# Altium project NC1-1BB.PrjPcb
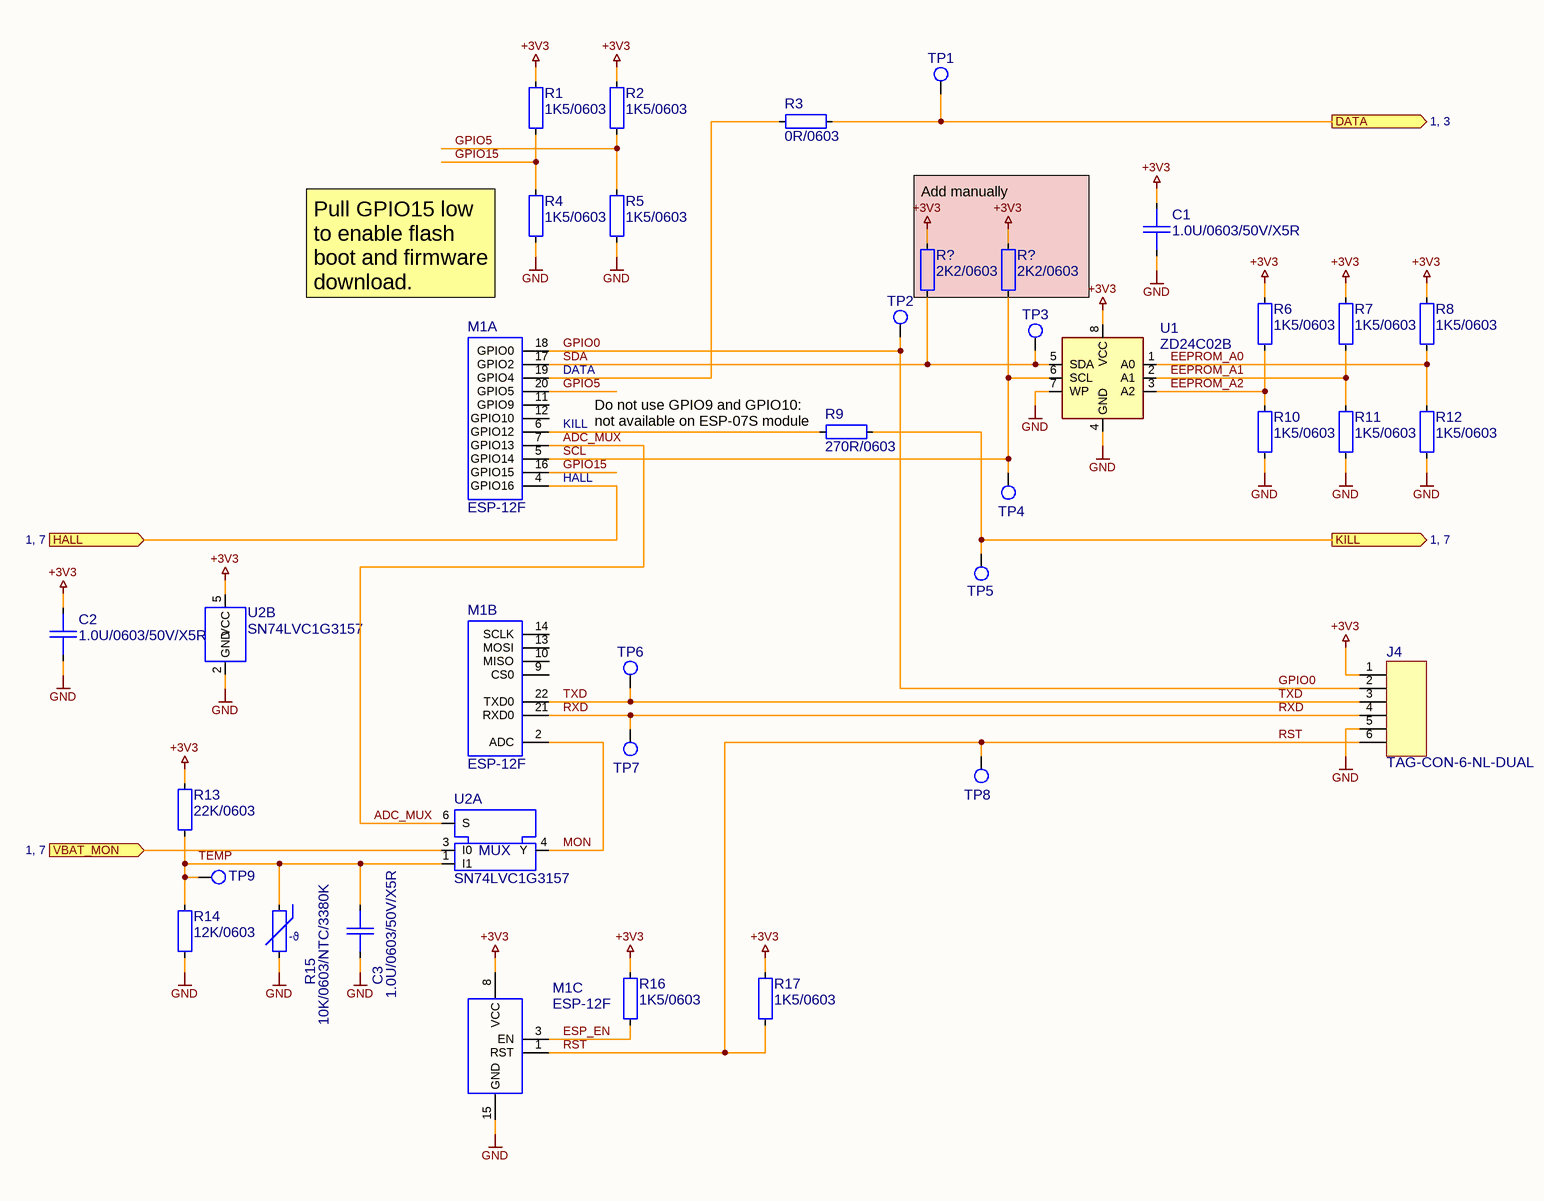
[diagram p0: Control.SchDoc]
Author: ahorat / daniw; Index_Main: B; Index_Sub: B; Layout_Designer: daniw; PCB_NAME: NC1-1; Project: NightCone; Schema_Designer: ahorat / daniw
4 sheets, 129 parts. Net scope: hierarchical (ports join the sheet entries above them; power ports are global).
Board files: NC1-1B-BASIS.PcbDoc, NC1-1B-PANEL_Single.PcbDoc
Sheets:
  Control.SchDoc
  FailSafe.SchDoc
  Lights.SchDoc
  Power.SchDoc

## Sheet Control.SchDoc: Control Module
size A3; SheetNumber: 2; SheetTotal: 7

### Parts
(Parts that share a designator on the sheet are numbered #1, #2 ... from top to bottom, then left to right.)
C1  1.0U/0603/50V/X5R  [CAP0603_X7R]
C2  1.0U/0603/50V/X5R  [CAP0603_X7R]
C3  1.0U/0603/50V/X5R  [CAP0603_X7R]
J4  TAG-CON-6-NL-DUAL  [TC2030-NL-2]
M1  ESP-12F  [ESP-12F]  (parts A,B,C of 3)
R1  1K5/0603  [R0603-0.40-WW]
R2  1K5/0603  [R0603-0.40-WW]
R3  0R/0603  [R0603-0.40-WW]
R4  1K5/0603  [R0603-0.40-WW]
R5  1K5/0603  [R0603-0.40-WW]
R6  1K5/0603  [R0603-0.40-WW]
R7  1K5/0603  [R0603-0.40-WW]
R8  1K5/0603  [R0603-0.40-WW]
R9  270R/0603  [R0603-0.40-WW]
R10  1K5/0603  [R0603-0.40-WW]
R11  1K5/0603  [R0603-0.40-WW]
R12  1K5/0603  [R0603-0.40-WW]
R13  22K/0603  [R0603-0.40-WW]
R14  12K/0603  [R0603-0.40-WW]
R15  10K/0603/NTC/3380K  [R0603-0.40-WW]
R16  1K5/0603  [R0603-0.40-WW]
R17  1K5/0603  [R0603-0.40-WW]
R?#1  2K2/0603  [R0603-0.40-WW]
R?#2  2K2/0603  [R0603-0.40-WW]
TP1  TP_THD_1.5/0.8  [TP_THD_1.5/0.8]  (value not drawn)  (no BOM)
TP2  TP_THD_1.5/0.8  [TP_THD_1.5/0.8]  (value not drawn)  (no BOM)
TP3  TP_THD_1.5/0.8  [TP_THD_1.5/0.8]  (value not drawn)  (no BOM)
TP4  TP_THD_1.5/0.8  [TP_THD_1.5/0.8]  (value not drawn)  (no BOM)
TP5  TP_THD_1.5/0.8  [TP_THD_1.5/0.8]  (value not drawn)  (no BOM)
TP6  TP_THD_1.5/0.8  [TP_THD_1.5/0.8]  (value not drawn)  (no BOM)
TP7  TP_THD_1.5/0.8  [TP_THD_1.5/0.8]  (value not drawn)  (no BOM)
TP8  TP_THD_1.5/0.8  [TP_THD_1.5/0.8]  (value not drawn)  (no BOM)
TP9  TP_THD_1.5/0.8  [TP_THD_1.5/0.8]  (value not drawn)  (no BOM)
U1  ZD24C02B  [SOP127P600X155-8-SW]
U2  SN74LVC1G3157  [SOT65P210X95-6-SE]  (parts A,B of 2)

### Ports
DATA (out, see 1, 3), HALL (in, see 1, 7), KILL (out, see 1, 7), VBAT_MON (in, see 1, 7)

### Nets
+3V3: C1.1 C2.1 J4.1 M1.8(VCC) R1.1 R2.1 R6.1 R7.1 R8.1 R13.1 R16.1 R17.1 R?#1.1 R?#2.1 U1.8(VCC) U2.5(VCC)
GND: C1.2 C2.2 C3.2 J4.5 M1.15(GND) R4.2 R5.2 R10.2 R11.2 R12.2 R14.2 R15.2 U1.4(GND) U1.7(WP) U2.2(GND)
ADC_MUX: M1.7(GPIO13) U2.6(S)
EEPROM_A0: R8.2 R12.1 U1.1(A0)
EEPROM_A1: R7.2 R11.1 U1.2(A1)
EEPROM_A2: R6.2 R10.1 U1.3(A2)
ESP_EN: M1.3(EN) R16.2
GPIO0: J4.2 M1.18(GPIO0) TP2.1
GPIO5: M1.20(GPIO5) R2.2 R5.1
GPIO15: M1.16(GPIO15) R1.2 R4.1
MON: M1.2(ADC) U2.4(Y)
RST: J4.6 M1.1(RST) R17.2 TP8.1
RXD: J4.4 M1.21(RXD0) TP7.1
SCL: M1.5(GPIO14) R?#2.2 TP4.1 U1.6(SCL)
SDA: M1.17(GPIO2) R?#1.2 TP3.1 U1.5(SDA)
TEMP: C3.1 R13.2 R14.1 R15.1 TP9.1 U2.1(I1)
TXD: J4.3 M1.22(TXD0) TP6.1
NetM1_4: M1.4(GPIO16) ; port HALL
NetM1_6: M1.6(GPIO12) R9.1
NetM1_19: M1.19(GPIO4) R3.1
NetR3_2: R3.2 TP1.1 ; port DATA
NetR9_2: R9.2 TP5.1 ; port KILL
NetU2_3: U2.3(I0) ; port VBAT_MON

Not connected (* = marked no-connect by the designer): M1 9(CS0) 10(MISO) 11(GPIO9) 12(GPIO10) 13(MOSI) 14(SCLK)

### Notes on the sheet
- Pull GPIO15 low to enable flash boot and firmware download.
- (near R?#1) Add manually
- (near M1) DATA
- (near M1) KILL
- (near M1) HALL
- (near R9) Do not use GPIO9 and GPIO10:
  not available on ESP-07S module
- Date:
- Size:
- A3
- Schema:
- Layout:
- (in symbol 10K/0603/NTC/3380K) -ϑ
- (in symbol SN74LVC1G3157, part A) MUX

### Library data of the parts
C1-C3 = 1.0U/0603/50V/X5R: CAP SM 0603 1.0uF 50V X5R; Manufacturer: GENERIC; Manufacturer 1: Samsung Electro-Mechanics; Manufacturer Part Number 1: CL10A105KB8NNNC; Absolute Value: 1E-6; Eurocircuits GPN: GPC0603105-X5R; Part Number: 1.0U/0603/50V/X5R; Package: 0603; Value: 1.0uF; Manufacturer Part Number 3: CL10A105KB8NNNC; Supplier 3: LCSC; Supplier Part Number 3: C15849; JLC Type: Basic; HelpURL: https://mm.digikey.com/Volume0/opasdata/d220001/medias/docus/658/CL10A105KB8NNNC_Spec.pdf; Supplier 1: Digi-Key; Supplier Part Number 1: 1276-1860-1-ND
J4 = TAG-CON-6-NL-DUAL: Tag-Connect 2030-NL, 6 pins, no legs, two-sided; Part Number: TAG-CON-6-NL-DUAL; Manufacturer: TAG-CONNECT; HelpURL: https://www.tag-connect.com/wp-content/uploads/bsk-pdf-manager/2022/06/TC2030-MCP-NL.pdf
M1 = ESP-12F: ESP8266 based Module with 4MByte Storage; Manufacturer: AI-Thinker; Part Number: ESP-12F; Package: Board; Manufacturer 3: Ai-Thinker; Manufacturer Part Number 3: ESP-12F(ESP8266MOD); Supplier 3: LCSC; Supplier Part Number 3: C82891; JLC Type: Extended
R1 R2 R4-R8 R10-R12 R16 R17 = 1K5/0603: RES SM 0603 1K5; Manufacturer: GENERIC; Manufacturer 1: YAGEO; Manufacturer Part Number 1: RC0603FR-131K5L; Absolute Value: 1500; Part Number: 1K5/0603; Package: 0603; Value: 1K5; HelpURL: https://www.yageo.com/upload/media/product/app/datasheet/rchip/pyu-rc_group_51_rohs_l.pdf; Supplier 1: Digi-Key; Supplier Part Number 1: 13-RC0603FR-131K5LCT-ND; Manufacturer 2: YAGEO; Manufacturer Part Number 2: RC0603FR-101K5L; Supplier 2: Digi-Key; Supplier Part Number 2: 13-RC0603FR-101K5LCT-ND; Manufacturer 3: UNI-ROYAL(Uniroyal Elec); Manufacturer Part Number 3: 0603WAF1501T5E; Supplier 3: LCSC; Supplier Part Number 3: C22843; JLC Type: Basic
R3 = 0R/0603: RES SM 0603 0R; Manufacturer: GENERIC; Manufacturer 1: YAGEO; Manufacturer Part Number 1: RC0603FR-070RL; Absolute Value: 0; Eurocircuits GPN: GPR06030R; Part Number: 0R/0603; Package: 0603; Value: 0R; HelpURL: https://www.yageo.com/upload/media/product/app/datasheet/rchip/pyu-rc_group_51_rohs_l.pdf; Supplier 1: Digi-Key; Supplier Part Number 1: 311-0.0HRCT-ND; Manufacturer 2: YAGEO; Manufacturer Part Number 2: RC0603FR-130RL; Supplier 2: Digi-Key; Supplier Part Number 2: 13-RC0603FR-130RLCT-ND; Manufacturer 3: UNI-ROYAL(Uniroyal Elec); Manufacturer Part Number 3: 0603WAF0000T5E; Supplier 3: LCSC; Supplier Part Number 3: C21189; JLC Type: Basic
R9 = 270R/0603: RES SM 0603 270R; Manufacturer: GENERIC; Manufacturer 1: YAGEO; Manufacturer Part Number 1: RC0603FR-13270RL; Absolute Value: 270; Eurocircuits GPN: GPR0603270R; Part Number: 270R/0603; Package: 0603; Value: 270R; HelpURL: https://www.yageo.com/upload/media/product/productsearch/datasheet/rchip/PYu-RC_Group_51_RoHS_L_12.pdf; Supplier 1: Digi-Key; Supplier Part Number 1: 13-RC0603FR-13270RLCT-ND; Manufacturer 2: YAGEO; Manufacturer Part Number 2: RC0603FR-10270RL; Supplier 2: Digi-Key; Supplier Part Number 2: 13-RC0603FR-10270RLCT-ND; Manufacturer 3: UNI-ROYAL(Uniroyal Elec); Manufacturer Part Number 3: 0603WAF2700T5E; Supplier 3: LCSC; Supplier Part Number 3: C22966; JLC Type: Basic
R13 = 22K/0603: RES SM 0603 22K; Manufacturer: GENERIC; Manufacturer 1: YAGEO; Manufacturer Part Number 1: RC0603FR-1322KL; Absolute Value: 22000; Eurocircuits GPN: GPR060322K; Part Number: 22K/0603; Package: 0603; Value: 22K; HelpURL: https://www.yageo.com/upload/media/product/app/datasheet/rchip/pyu-rc_group_51_rohs_l.pdf; Supplier 1: Digi-Key; Supplier Part Number 1: 13-RC0603FR-1322KLCT-ND; Manufacturer 2: YAGEO; Manufacturer Part Number 2: RC0603FR-1022KL; Supplier 2: Digi-Key; Supplier Part Number 2: 13-RC0603FR-1022KLCT-ND; Manufacturer 3: UNI-ROYAL(Uniroyal Elec); Manufacturer Part Number 3: 0603WAF2202T5E; Supplier 3: LCSC; Supplier Part Number 3: C31850; JLC Type: Basic
R14 = 12K/0603: RES SM 0603 12K; Manufacturer: GENERIC; Manufacturer 1: YAGEO; Manufacturer Part Number 1: RC0603FR-1312KL; Absolute Value: 12000; Eurocircuits GPN: GPR060312K; Part Number: 12K/0603; Package: 0603; Value: 12K; HelpURL: https://www.yageo.com/upload/media/product/app/datasheet/rchip/pyu-rc_group_51_rohs_l.pdf; Supplier 1: Digi-Key; Supplier Part Number 1: 13-RC0603FR-1312KLCT-ND; Manufacturer 2: YAGEO; Manufacturer Part Number 2: RC0603FR-1012KL; Supplier 2: Digi-Key; Supplier Part Number 2: 13-RC0603FR-1012KLCT-ND
R15 = 10K/0603/NTC/3380K: RES NTC SM 0603 10K; Manufacturer: GENERIC; Manufacturer 1: Murata; Manufacturer Part Number 1: NCU18XH103E60RB; Absolute Value: 10000; Part Number: 10K/0603/NTC/3380K; Package: 603; Value: 10K; HelpURL: https://www.murata.com/en-us/api/pdfdownloadapi?cate=luNTCforTempeSenso&partno=NCU18XH103E60RB; Supplier 1: Digi-Key; Supplier Part Number 1: 490-18164-1-ND; Manufacturer 3: Sunlord; Manufacturer Part Number 3: SDNT1608X103F3380FTF; Supplier 3: LCSC; Supplier Part Number 3: C316397; JLC Type: Extended
R?#1 R?#2 = 2K2/0603: RES SM 0603 2K2; Manufacturer: GENERIC; Manufacturer 1: YAGEO; Manufacturer Part Number 1: RC0603FR-132K2L; Absolute Value: 2200; Eurocircuits GPN: GPR06032K2; Part Number: 2K2/0603; Package: 0603; Value: 2K2; HelpURL: https://www.yageo.com/upload/media/product/app/datasheet/rchip/pyu-rc_group_51_rohs_l.pdf; Supplier 1: Digi-Key; Supplier Part Number 1: 13-RC0603FR-132K2LCT-ND; Manufacturer 2: YAGEO; Manufacturer Part Number 2: RC0603FR-102K2L; Supplier 2: Digi-Key; Supplier Part Number 2: 13-RC0603FR-102K2LCT-ND; Manufacturer 3: YAGEO; Manufacturer Part Number 3: RC0603JR-072K2L; Supplier 3: LCSC; Supplier Part Number 3: C113303
TP1-TP9 = TP_THD_1.5/0.8: THT Test Point 1.5/0.8mm; Manufacturer: NONE; Part Number: TP_THD_1.5/0.8
U1 = ZD24C02B: I2C-Compatible (2-wire) Serial EEPROM 2K bits; Manufacturer: Zetta; Part Number: ZD24C02B; Package: SOIC-8; HelpURL: https://datasheet.lcsc.com/lcsc/2402020955_Zetta-ZD24C02B-SSGMB_C5374786.pdf; Manufacturer 3: Zetta; Manufacturer Part Number 3: ZD24C02B-SSGMB; Supplier 3: LCSC; Supplier Part Number 3: C5374786; JLC Type: Extended
U2 = SN74LVC1G3157: Single-Pole-Double-Throw Analog Switch; Manufacturer: TI; Part Number: SN74LVC1G3157; Package: SOT-363-6; Manufacturer 3: Texas Instruments; Manufacturer Part Number 3: SN74LVC1G3157DCKR; Supplier 3: LCSC; Supplier Part Number 3: C38663

## Sheet FailSafe.SchDoc: FailSafe
size A3; SheetNumber: 3; SheetTotal: 7
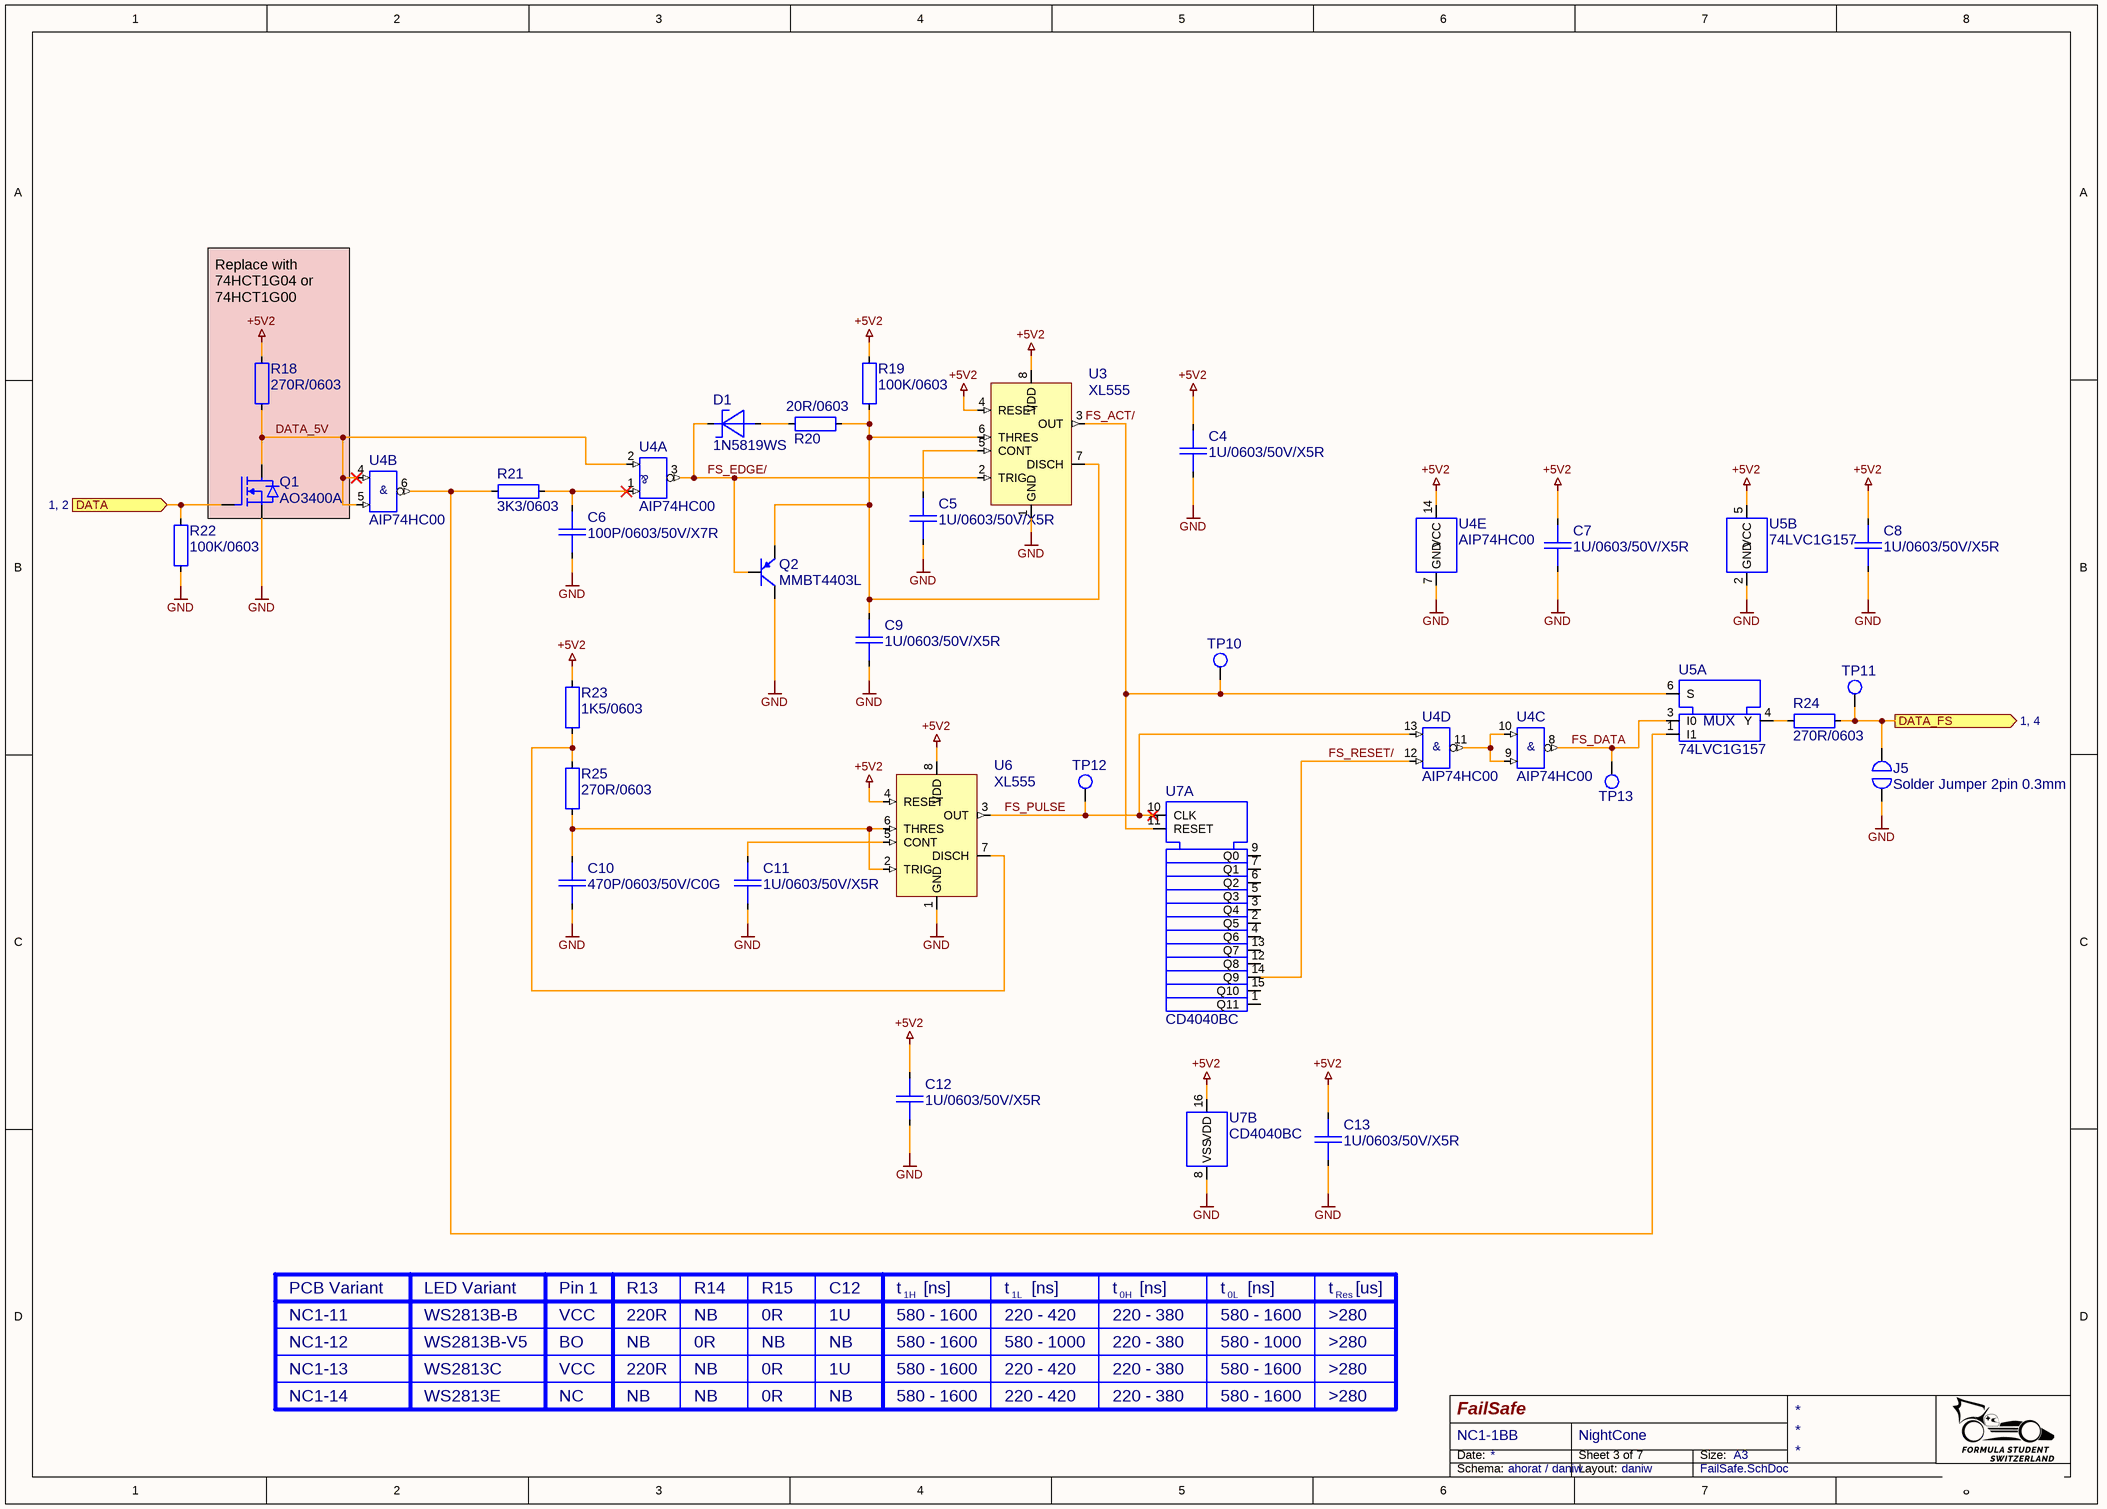
[diagram p1: FailSafe.SchDoc]

### Parts
C4  1U/0603/50V/X5R  [CAP0603_X7R]
C5  1U/0603/50V/X5R  [CAP0603_X7R]
C6  100P/0603/50V/X7R  [CAP0603_X7R]
C7  1U/0603/50V/X5R  [CAP0603_X7R]
C8  1U/0603/50V/X5R  [CAP0603_X7R]
C9  1U/0603/50V/X5R  [CAP0603_X7R]
C10  470P/0603/50V/C0G  [CAP0603_C0G]
C11  1U/0603/50V/X5R  [CAP0603_X7R]
C12  1U/0603/50V/X5R  [CAP0603_X7R]
C13  1U/0603/50V/X5R  [CAP0603_X7R]
D1  1N5819WS  [SOD2513X100]
J5  Solder Jumper 2pin 0.3mm  [Solder_Jumper_2pin_0.3mm]
Q1  AO3400A  [SOT2395P280X125-3-SE]
Q2  MMBT4403L  [SOT2395P280X125-3-SE]
R18  270R/0603  [R0603-0.40-WW]
R19  100K/0603  [R0603-0.40-WW]
R20  20R/0603  [R0603-0.40-WW]
R21  3K3/0603  [R0603-0.40-WW]
R22  100K/0603  [R0603-0.40-WW]
R23  1K5/0603  [R0603-0.40-WW]
R24  270R/0603  [R0603-0.40-WW]
R25  270R/0603  [R0603-0.40-WW]
TP10  TP_THD_1.5/0.8  [TP_THD_1.5/0.8]  (value not drawn)  (no BOM)
TP11  TP_THD_1.5/0.8  [TP_THD_1.5/0.8]  (value not drawn)  (no BOM)
TP12  TP_THD_1.5/0.8  [TP_THD_1.5/0.8]  (value not drawn)  (no BOM)
TP13  TP_THD_1.5/0.8  [TP_THD_1.5/0.8]  (value not drawn)  (no BOM)
U3  XL555  [SOP127P600X155-8-SW]
U4  AIP74HC00  [SOP127P600X155-14-SW]  (parts A,B,C,D,E of 5)
U5  74LVC1G157  [SOT65P210X95-6-SE]  (parts A,B of 2)
U6  XL555  [SOP127P600X155-8-SW]
U7  CD4040BC  [SOP127P600X155-16-SW]  (parts A,B of 2)

### Ports
DATA (in, see 1, 2), DATA_FS (out, see 1, 4)

### Nets
+5V2: C4.1 C7.1 C8.1 C12.1 C13.1 R18.1 R19.1 R23.1 U3.4(RESET) U3.8(VDD) U4.14(VCC) U5.5(VCC) U6.4(RESET) U6.8(VDD) U7.16(VDD)
GND: C4.2 C5.2 C6.2 C7.2 C8.2 C9.2 C10.2 C11.2 C12.2 C13.2 J5.2 Q1.2(SOURCE) Q2.3(COLLECTOR) R22.1 U3.1(GND) U4.7(GND) U5.2(GND) U6.1(GND) U7.8(VSS)
DATA_5V: Q1.3(DRAIN) R18.2 U4.2(B0) U4.4(A1) U4.5(B1)
FS_ACT/: TP10.1 U3.3(OUT) U5.6(S) U7.11(RESET)
FS_DATA: TP13.1 U4.8(Y2) U5.3(I0)
FS_EDGE/: D1.1 Q2.1(BASE) U3.2(TRIG) U4.3(Y0)
FS_PULSE: TP12.1 U4.13(A3) U6.3(OUT) U7.10(CLK)
FS_RESET/: U4.12(B3) U7.14(Q9)
NetC5_1: C5.1 U3.5(CONT)
NetC6_1: C6.1 R21.2 U4.1(A0)
NetC9_1: C9.1 Q2.2(EMITTER) R19.2 R20.2 U3.6(THRES) U3.7(DISCH)
NetC10_1: C10.1 R25.2 U6.2(TRIG) U6.6(THRES)
NetC11_1: C11.1 U6.5(CONT)
NetD1_2: D1.2 R20.1
NetJ5_1: J5.1 R24.2 TP11.1 ; port DATA_FS
NetQ1_1: Q1.1(GATE) R22.2 ; port DATA
NetR21_1: R21.1 U4.6(Y1) U5.1(I1)
NetR23_2: R23.2 R25.1 U6.7(DISCH)
NetR24_1: R24.1 U5.4(Y)
NetU4_9: U4.9(B2) U4.10(A2) U4.11(Y3)

Not connected (* = marked no-connect by the designer): U7 1(Q11) 2(Q5) 3(Q4) 4(Q6) 5(Q3) 6(Q2) 7(Q1) 9(Q0) 12(Q8) 13(Q7) 15(Q10)

### Notes on the sheet
- Replace with 74HCT1G04 or 74HCT1G00
- PCB Variant
- NC1-11
- LED Variant
- WS2813B-B
- Pin 1
- VCC
- R13
- 220R
- R14
- NB
- R15
- 0R
- C12
- 1U
- t
- 580 - 1600
- 1H
- [ns]
- 220 - 420
- 1L
- 220 - 380
- 0H
- 0L
- >280
- Res
- [us]
- NC1-12
- NC1-13
- NC1-14
- WS2813B-V5
- WS2813C
- WS2813E
- BO
- NC
- 580 - 1000
- Date:
- Size:
- A3
- Schema:
- Layout:
- (in symbol 74LVC1G157, part A) MUX
- (in symbol AIP74HC00, part A) &
- (in symbol AIP74HC00, part B) &
- (in symbol AIP74HC00, part C) &
- (in symbol AIP74HC00, part D) &

### Library data of the parts
C4 C5 C7-C9 C11-C13 = 1U/0603/50V/X5R: CAP SM 0603 1.0uF 50V X5R; Manufacturer: GENERIC; Absolute Value: 1E-6; Part Number: 1U/0603/50V/X5R; Package: 603; Value: 1.0uF; Manufacturer Part Number 3: CL10A105KB8NNNC; Supplier 3: LCSC; Supplier Part Number 3: C15849; JLC Type: Basic
C6 = 100P/0603/50V/X7R: CAP SM 0603 100pF 50V X7R; Manufacturer: GENERIC; Manufacturer 1: YAGEO; Manufacturer Part Number 1: CC0603KPX7R9BB101; Absolute Value: 1E-10; Eurocircuits GPN: GPC0603101; Part Number: 100P/0603/50V/X7R; Package: 0603; Value: 100pF; HelpURL: https://www.yageo.com/upload/media/product/app/datasheet/mlcc/upy-gphc_x7r_6_3v-to-250v.pdf; Supplier 1: Digi-Key; Supplier Part Number 1: 13-CC0603KPX7R9BB101CT-ND; Manufacturer 2: YAGEO; Manufacturer Part Number 2: CC0603KRX7R9BB101; Supplier 2: Digi-Key; Supplier Part Number 2: 311-3601-1-ND
C10 = 470P/0603/50V/C0G: CAP SM 0603 470pF 50V C0G; Manufacturer: GENERIC; Manufacturer 1: YAGEO; Manufacturer Part Number 1: CC0603JRNPO9BN471; Absolute Value: 4.7E-10; Part Number: 470P/0603/50V/C0G; Package: 603; Value: 470pF; HelpURL: https://www.yageo.com/upload/media/product/productsearch/datasheet/mlcc/UPY-GP_NP0_16V-to-50V_18.pdf; Supplier 1: Digi-Key; Supplier Part Number 1: 311-1520-1-ND; Manufacturer 2: YAGEO; Manufacturer Part Number 2: CC0603KRNPO9BN471; Supplier 2: Digi-Key; Supplier Part Number 2: 311-4038-1-ND; Manufacturer Part Number 3: GCM1885C1H471JA16D; Supplier 3: LCSC; Supplier Part Number 3: C126566; JLC Type: Extended
D1 = 1N5819WS: 40V 600mV@1A 1A SOD-323 Schottky Barrier Diodes (SBD) ROHS; Manufacturer: GENERIC; Part Number: 1N5819WS; Package: SOD323; Value: 1N5819WS; Absolute Value: 40V; HelpURL: https://datasheet.lcsc.com/lcsc/2204281430_Guangdong-Hottech-1N5819WS_C191023.pdf; Manufacturer 3: Guangdong Hottech; Manufacturer Part Number 3: 1N5819WS; Supplier 3: LCSC; Supplier Part Number 3: C191023; JLC Type: Basic
J5 = Solder_Jumper_2pin_0.3mm: Solder jumper with two pins with a spacing of 0.3mm; Manufacturer: NONE; Part Number: Solder_Jumper_2pin_0.3mm
Q1 = AO3400A: 30V N-Channel MOSFET; Manufacturer: Alpha & Omega Semiconductor; Part Number: AO3400A; Package: SOT23; HelpURL: https://aosmd.com/res/data_sheets/AO3400A.pdf; Manufacturer 3: Alpha & Omega Semiconductor; Manufacturer Part Number 3: AO3400A; Supplier 3: LCSC; Supplier Part Number 3: C20917; JLC Type: Basic
Q2 = MMBT4403L: Switching Transistor PNP Silicon; Manufacturer: ON SEMI; Part Number: MMBT4403L; Package: SOT23; HelpURL: https://www.onsemi.com/pdf/datasheet/mmbt4403lt1-d.pdf; Manufacturer 3: ONSEMI; Manufacturer Part Number 3: MMBT4403LT1G; Supplier 3: LCSC; Supplier Part Number 3: C78864; JLC Type: Extended
R18 = 270R/0603: as R9 on sheet Control; Part Number: 270R/0603; Package: 0603; Value: 270R; HelpURL: https://www.yageo.com/upload/media/product/productsearch/datasheet/rchip/PYu-RC_Group_51_RoHS_L_12.pdf; Supplier 1: Digi-Key; Supplier Part Number 1: 13-RC0603FR-13270RLCT-ND; Manufacturer 2: YAGEO; Manufacturer Part Number 2: RC0603FR-10270RL; Supplier 2: Digi-Key; Supplier Part Number 2: 13-RC0603FR-10270RLCT-ND; Manufacturer 3: UNI-ROYAL(Uniroyal Elec); Manufacturer Part Number 3: 0603WAF2700T5E; Supplier 3: LCSC; Supplier Part Number 3: C22966; JLC Type: Basic
R19 R22 = 100K/0603: RES SM 0603 100K; Manufacturer: GENERIC; Manufacturer 1: YAGEO; Manufacturer Part Number 1: RC0603FR-13100KL; Absolute Value: 100000; Part Number: 100K/0603; Package: 0603; Value: 100K; HelpURL: https://www.yageo.com/upload/media/product/productsearch/datasheet/rchip/PYu-RC_Group_51_RoHS_L_12.pdf; Supplier 1: Digi-Key; Supplier Part Number 1: 13-RC0603FR-13100KLCT-ND; Manufacturer 2: YAGEO; Manufacturer Part Number 2: RC0603FR-10100KL; Supplier 2: Digi-Key; Supplier Part Number 2: 13-RC0603FR-10100KLCT-ND; Manufacturer 3: UNI-ROYAL(Uniroyal Elec); Manufacturer Part Number 3: 0603WAF1003T5E; Supplier 3: LCSC; Supplier Part Number 3: C25803; JLC Type: Basic
R20 = 20R/0603: RES SM 0603 20R; Manufacturer: GENERIC; Manufacturer 1: YAGEO; Manufacturer Part Number 1: RC0603FR-1320RL; Absolute Value: 20; Part Number: 20R/0603; Package: 0603; Value: 20R; HelpURL: https://www.yageo.com/upload/media/product/app/datasheet/rchip/pyu-rc_group_51_rohs_l.pdf; Supplier 1: Digi-Key; Supplier Part Number 1: 13-RC0603FR-1320RLCT-ND; Manufacturer 2: YAGEO; Manufacturer Part Number 2: RC0603FR-1020RL; Supplier 2: Digi-Key; Supplier Part Number 2: 13-RC0603FR-1020RLCT-ND; Manufacturer 3: UNI-ROYAL(Uniroyal Elec); Manufacturer Part Number 3: 0603WAF200JT5E; Supplier 3: LCSC; Supplier Part Number 3: C22950; JLC Type: Basic
R21 = 3K3/0603: RES SM 0603 3K3; Manufacturer: GENERIC; Manufacturer 1: YAGEO; Manufacturer Part Number 1: RC0603FR-133K3L; Absolute Value: 3300; Eurocircuits GPN: GPR06033K3; Part Number: 3K3/0603; Package: 0603; Value: 3K3; HelpURL: https://www.yageo.com/upload/media/product/app/datasheet/rchip/pyu-rc_group_51_rohs_l.pdf; Supplier 1: Digi-Key; Supplier Part Number 1: 13-RC0603FR-133K3LCT-ND; Manufacturer 2: YAGEO; Manufacturer Part Number 2: RC0603FR-103K3L; Supplier 2: Digi-Key; Supplier Part Number 2: 13-RC0603FR-103K3LCT-ND
R23 = 1K5/0603: as R1 on sheet Control; Part Number: 1K5/0603; Package: 0603; Value: 1K5; HelpURL: https://www.yageo.com/upload/media/product/app/datasheet/rchip/pyu-rc_group_51_rohs_l.pdf; Supplier 1: Digi-Key; Supplier Part Number 1: 13-RC0603FR-131K5LCT-ND; Manufacturer 2: YAGEO; Manufacturer Part Number 2: RC0603FR-101K5L; Supplier 2: Digi-Key; Supplier Part Number 2: 13-RC0603FR-101K5LCT-ND; Manufacturer 3: UNI-ROYAL(Uniroyal Elec); Manufacturer Part Number 3: 0603WAF1501T5E; Supplier 3: LCSC; Supplier Part Number 3: C22843; JLC Type: Basic
R24 R25 = 270R/0603: RES SM 0603 270R; Manufacturer: GENERIC; Manufacturer 1: YAGEO; Manufacturer Part Number 1: RC0603FR-13270RL; Absolute Value: 270; Part Number: 270R/0603; Package: 0603; Value: 270R; HelpURL: https://www.yageo.com/upload/media/product/productsearch/datasheet/rchip/PYu-RC_Group_51_RoHS_L_12.pdf; Supplier 1: Digi-Key; Supplier Part Number 1: 13-RC0603FR-13270RLCT-ND; Manufacturer 2: YAGEO; Manufacturer Part Number 2: RC0603FR-10270RL; Supplier 2: Digi-Key; Supplier Part Number 2: 13-RC0603FR-10270RLCT-ND; Manufacturer 3: UNI-ROYAL(Uniroyal Elec); Manufacturer Part Number 3: 0603WAF2700T5E; Supplier 3: LCSC; Supplier Part Number 3: C22966; JLC Type: Basic
TP10-TP13 = TP_THD_1.5/0.8: as TP1 on sheet Control; Part Number: TP_THD_1.5/0.8
U3 U6 = XL555: SOP-8 Timers / Clock Oscillators ROHS; Manufacturer: XINLUDA; Part Number: XL555; Package: SOP8; HelpURL: https://datasheet.lcsc.com/lcsc/2212101330_XINLUDA-XL555_C521186.pdf; Manufacturer 3: XINLUDA; Manufacturer Part Number 3: XL555; Supplier 3: LCSC; Supplier Part Number 3: C521186; JLC Type: Extended
U4 = AIP74HC00: Quad 2-input NAND; Manufacturer: Wuxi I-core Elec; Part Number: AIP74HC00; Package: SOP-14; Manufacturer 3: Wuxi I-core Elec; Manufacturer Part Number 3: AIP74HC00SA.TB; Supplier 3: LCSC; Supplier Part Number 3: C2943283; JLC Type: Extended
U5 = 74LVC1G157: Single 2-input multiplexer; Manufacturer: Nexperia; Part Number: 74LVC1G157; Package: SOT-363-6; Manufacturer 3: Nexperia; Manufacturer Part Number 3: 74LVC1G157GW,125; Supplier 3: LCSC; Supplier Part Number 3: C135822; JLC Type: Extended
U7 = CD4040BC: 12-Stage binary ripple Counter; Manufacturer: HGSEMI; Part Number: CD4040BC; Package: SOP-16; Manufacturer 3: HGSEMI; Manufacturer Part Number 3: CD4040BM/TR; Supplier 3: LCSC; Supplier Part Number 3: C725347; JLC Type: Extended

## Sheet Lights.SchDoc: LEDs
size A3; SheetNumber: 4; SheetTotal: 7
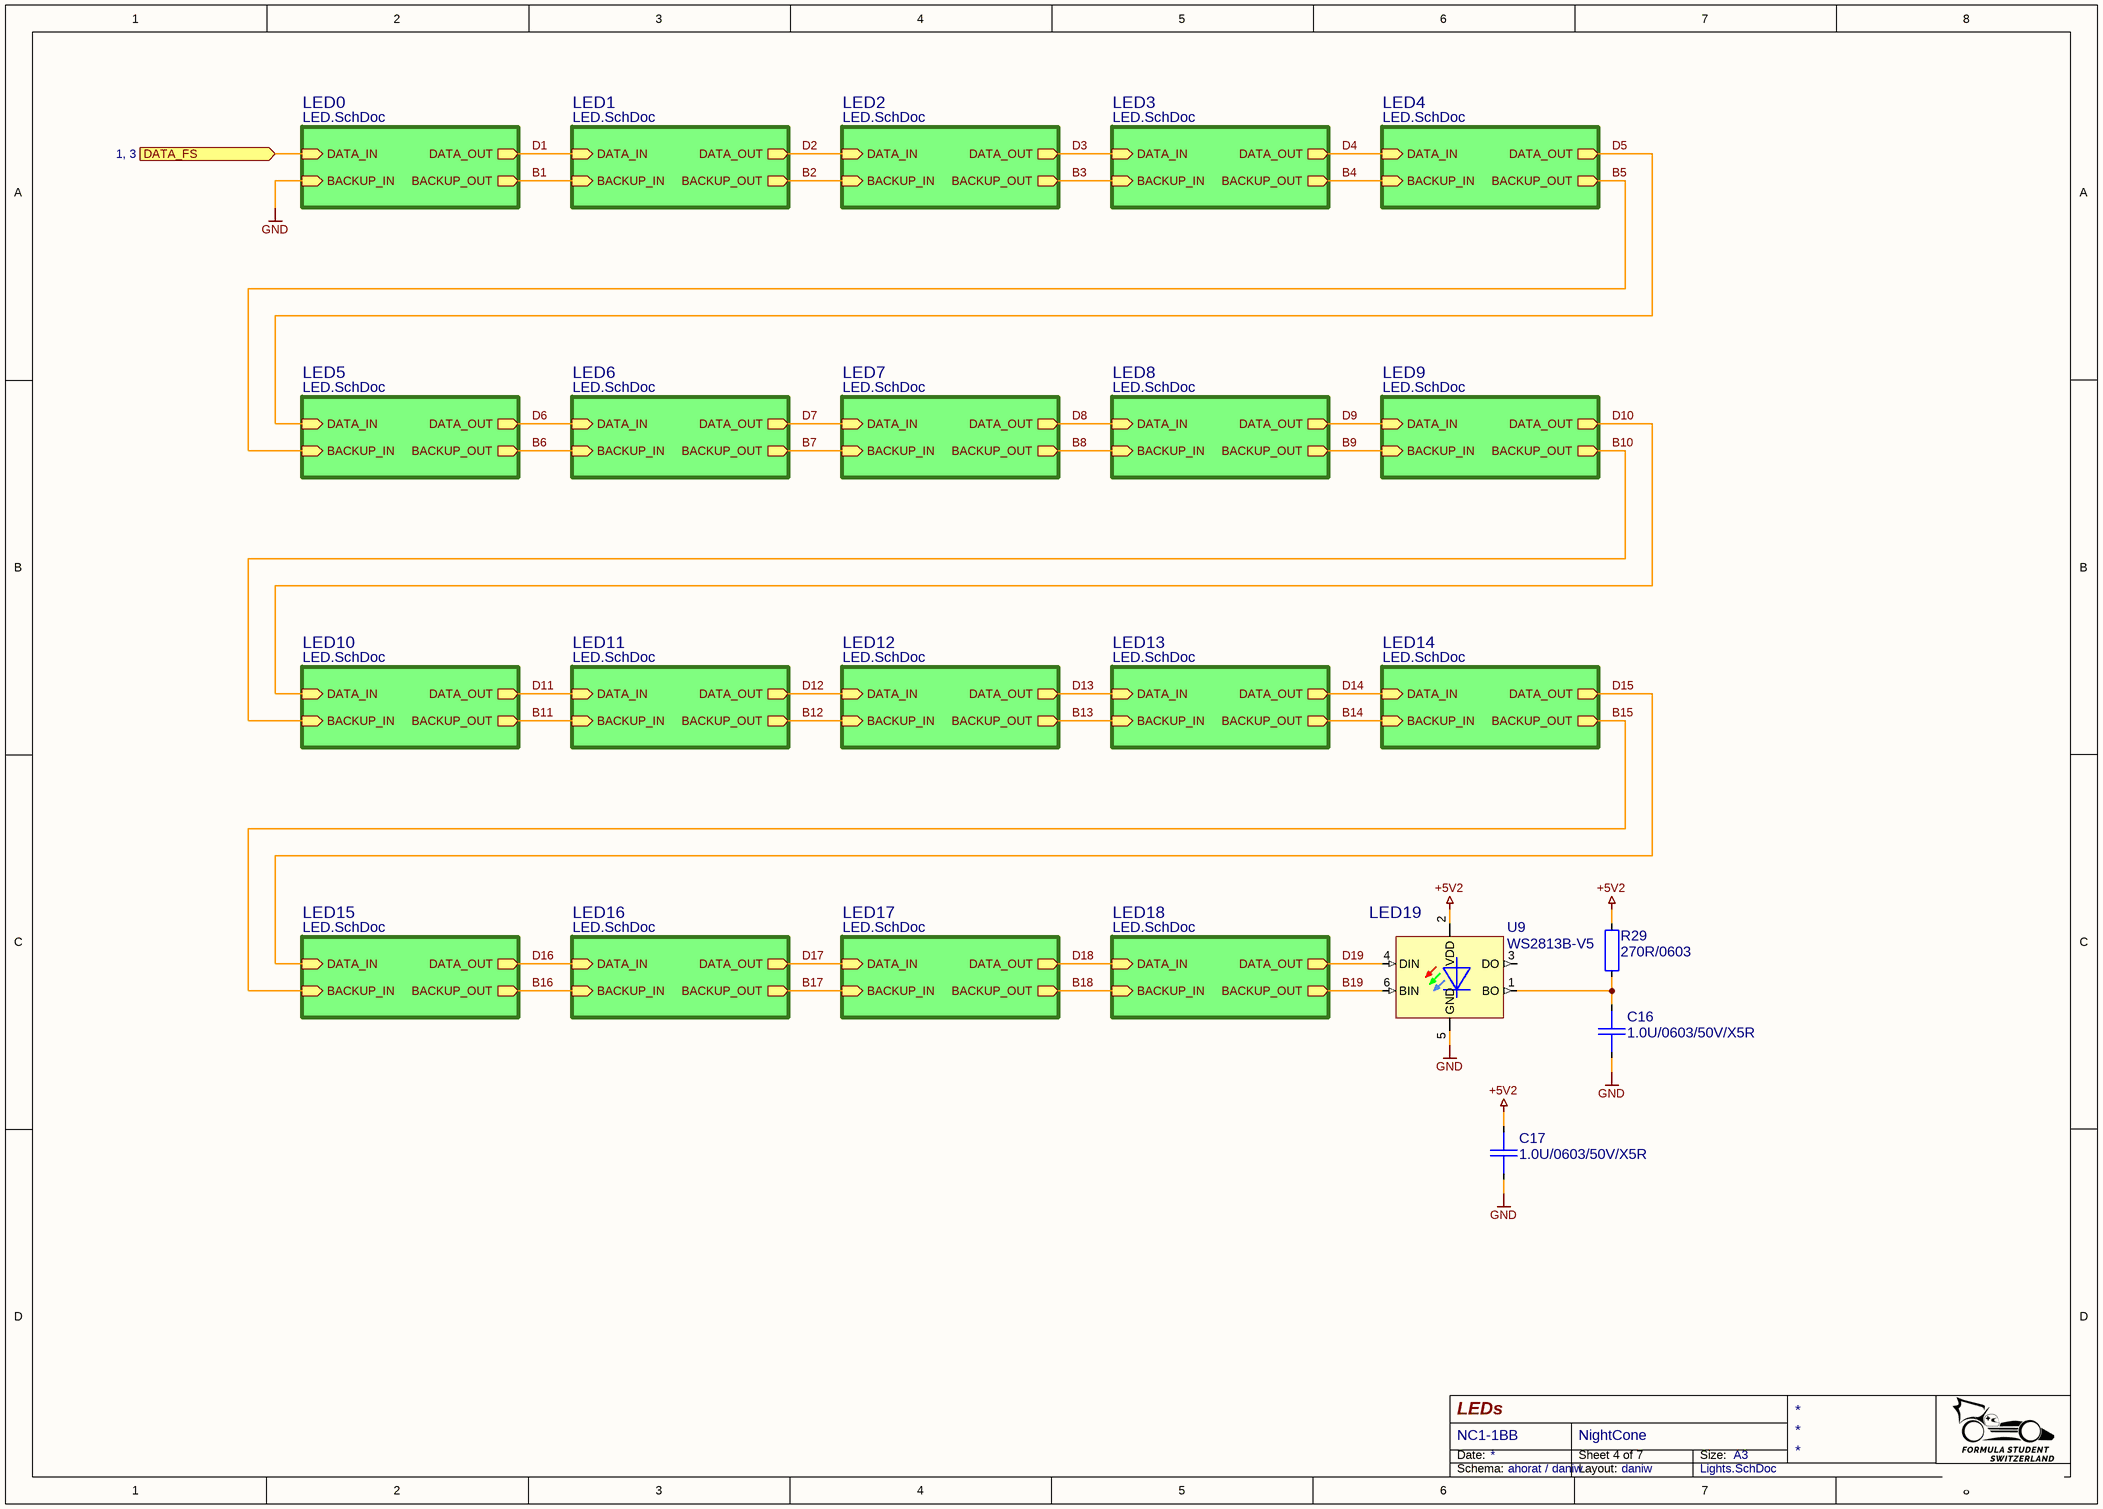
[diagram p2: Lights.SchDoc]

### Parts
C16  1.0U/0603/50V/X5R  [CAP0603_X7R]
C17  1.0U/0603/50V/X5R  [CAP0603_X7R]
R29  270R/0603  [R0603-0.40-WW]
U9  WS2813B-V5  [LEDM5050X165-6-SE]

### Sub-sheets
LED0 = LED.SchDoc (file not in this document): DATA_IN (in), BACKUP_IN (in), DATA_OUT (out), BACKUP_OUT (out)
LED1 = LED.SchDoc (file not in this document): DATA_IN (in), BACKUP_IN (in), DATA_OUT (out), BACKUP_OUT (out)
LED2 = LED.SchDoc (file not in this document): DATA_IN (in), BACKUP_IN (in), DATA_OUT (out), BACKUP_OUT (out)
LED3 = LED.SchDoc (file not in this document): DATA_IN (in), BACKUP_IN (in), DATA_OUT (out), BACKUP_OUT (out)
LED4 = LED.SchDoc (file not in this document): DATA_IN (in), BACKUP_IN (in), DATA_OUT (out), BACKUP_OUT (out)
LED5 = LED.SchDoc (file not in this document): DATA_IN (in), BACKUP_IN (in), DATA_OUT (out), BACKUP_OUT (out)
LED6 = LED.SchDoc (file not in this document): DATA_IN (in), BACKUP_IN (in), DATA_OUT (out), BACKUP_OUT (out)
LED7 = LED.SchDoc (file not in this document): DATA_IN (in), BACKUP_IN (in), DATA_OUT (out), BACKUP_OUT (out)
LED8 = LED.SchDoc (file not in this document): DATA_IN (in), BACKUP_IN (in), DATA_OUT (out), BACKUP_OUT (out)
LED9 = LED.SchDoc (file not in this document): DATA_IN (in), BACKUP_IN (in), DATA_OUT (out), BACKUP_OUT (out)
LED10 = LED.SchDoc (file not in this document): DATA_IN (in), BACKUP_IN (in), DATA_OUT (out), BACKUP_OUT (out)
LED11 = LED.SchDoc (file not in this document): DATA_IN (in), BACKUP_IN (in), DATA_OUT (out), BACKUP_OUT (out)
LED12 = LED.SchDoc (file not in this document): DATA_IN (in), BACKUP_IN (in), DATA_OUT (out), BACKUP_OUT (out)
LED13 = LED.SchDoc (file not in this document): DATA_IN (in), BACKUP_IN (in), DATA_OUT (out), BACKUP_OUT (out)
LED14 = LED.SchDoc (file not in this document): DATA_IN (in), BACKUP_IN (in), DATA_OUT (out), BACKUP_OUT (out)
LED15 = LED.SchDoc (file not in this document): DATA_IN (in), BACKUP_IN (in), DATA_OUT (out), BACKUP_OUT (out)
LED16 = LED.SchDoc (file not in this document): DATA_IN (in), BACKUP_IN (in), DATA_OUT (out), BACKUP_OUT (out)
LED17 = LED.SchDoc (file not in this document): DATA_IN (in), BACKUP_IN (in), DATA_OUT (out), BACKUP_OUT (out)
LED18 = LED.SchDoc (file not in this document): DATA_IN (in), BACKUP_IN (in), DATA_OUT (out), BACKUP_OUT (out)

### Ports
DATA_FS (in, see 1, 3)

### Nets
+5V2: C17.1 R29.1 U9.2(VDD)
GND: C16.2 C17.2 U9.5(GND) ; sheet LED0/BACKUP_IN
B1: sheet LED0/BACKUP_OUT, sheet LED1/BACKUP_IN
B2: sheet LED1/BACKUP_OUT, sheet LED2/BACKUP_IN
B3: sheet LED2/BACKUP_OUT, sheet LED3/BACKUP_IN
B4: sheet LED3/BACKUP_OUT, sheet LED4/BACKUP_IN
B5: sheet LED4/BACKUP_OUT, sheet LED5/BACKUP_IN
B6: sheet LED5/BACKUP_OUT, sheet LED6/BACKUP_IN
B7: sheet LED6/BACKUP_OUT, sheet LED7/BACKUP_IN
B8: sheet LED7/BACKUP_OUT, sheet LED8/BACKUP_IN
B9: sheet LED8/BACKUP_OUT, sheet LED9/BACKUP_IN
B10: sheet LED9/BACKUP_OUT, sheet LED10/BACKUP_IN
B11: sheet LED10/BACKUP_OUT, sheet LED11/BACKUP_IN
B12: sheet LED11/BACKUP_OUT, sheet LED12/BACKUP_IN
B13: sheet LED12/BACKUP_OUT, sheet LED13/BACKUP_IN
B14: sheet LED13/BACKUP_OUT, sheet LED14/BACKUP_IN
B15: sheet LED14/BACKUP_OUT, sheet LED15/BACKUP_IN
B16: sheet LED15/BACKUP_OUT, sheet LED16/BACKUP_IN
B17: sheet LED16/BACKUP_OUT, sheet LED17/BACKUP_IN
B18: sheet LED17/BACKUP_OUT, sheet LED18/BACKUP_IN
B19: U9.6(BIN) ; sheet LED18/BACKUP_OUT
D1: sheet LED0/DATA_OUT, sheet LED1/DATA_IN
D2: sheet LED1/DATA_OUT, sheet LED2/DATA_IN
D3: sheet LED2/DATA_OUT, sheet LED3/DATA_IN
D4: sheet LED3/DATA_OUT, sheet LED4/DATA_IN
D5: sheet LED4/DATA_OUT, sheet LED5/DATA_IN
D6: sheet LED5/DATA_OUT, sheet LED6/DATA_IN
D7: sheet LED6/DATA_OUT, sheet LED7/DATA_IN
D8: sheet LED7/DATA_OUT, sheet LED8/DATA_IN
D9: sheet LED8/DATA_OUT, sheet LED9/DATA_IN
D10: sheet LED9/DATA_OUT, sheet LED10/DATA_IN
D11: sheet LED10/DATA_OUT, sheet LED11/DATA_IN
D12: sheet LED11/DATA_OUT, sheet LED12/DATA_IN
D13: sheet LED12/DATA_OUT, sheet LED13/DATA_IN
D14: sheet LED13/DATA_OUT, sheet LED14/DATA_IN
D15: sheet LED14/DATA_OUT, sheet LED15/DATA_IN
D16: sheet LED15/DATA_OUT, sheet LED16/DATA_IN
D17: sheet LED16/DATA_OUT, sheet LED17/DATA_IN
D18: sheet LED17/DATA_OUT, sheet LED18/DATA_IN
D19: U9.4(DIN) ; sheet LED18/DATA_OUT
NetC16_1: C16.1 R29.2 U9.1(BO)
(unnamed): port DATA_FS, sheet LED0/DATA_IN

Not connected (* = marked no-connect by the designer): U9 3(DO)

### Notes on the sheet
- (near U9) LED19
- Date:
- Size:
- A3
- Schema:
- Layout:

### Library data of the parts
C16 C17 = 1.0U/0603/50V/X5R: as C1 on sheet Control; Part Number: 1.0U/0603/50V/X5R; Package: 0603; Value: 1.0uF; HelpURL: https://mm.digikey.com/Volume0/opasdata/d220001/medias/docus/658/CL10A105KB8NNNC_Spec.pdf; Supplier 1: Digi-Key; Supplier Part Number 1: 1276-1860-1-ND; Manufacturer Part Number 3: CL10A105KB8NNNC; Supplier 3: LCSC; Supplier Part Number 3: C15849; JLC Type: Basic
R29 = 270R/0603: as R24 on sheet FailSafe; Part Number: 270R/0603; Package: 0603; Value: 270R; HelpURL: https://www.yageo.com/upload/media/product/productsearch/datasheet/rchip/PYu-RC_Group_51_RoHS_L_12.pdf; Supplier 1: Digi-Key; Supplier Part Number 1: 13-RC0603FR-13270RLCT-ND; Manufacturer 2: YAGEO; Manufacturer Part Number 2: RC0603FR-10270RL; Supplier 2: Digi-Key; Supplier Part Number 2: 13-RC0603FR-10270RLCT-ND; Manufacturer 3: UNI-ROYAL(Uniroyal Elec); Manufacturer Part Number 3: 0603WAF2700T5E; Supplier 3: LCSC; Supplier Part Number 3: C22966; JLC Type: Basic
U9 = WS2813B-V5: Intelligent control LED integrated light source with backup Pin; Manufacturer: WorldSemi; Part Number: WS2813B-V5; Package: SMD5050; HelpURL: https://datasheet.lcsc.com/lcsc/2012110135_Worldsemi-WS2813B-V5_C965558.pdf; Manufacturer 3: WorldSemi; Manufacturer Part Number 3: WS2813B-V5; Supplier 3: LCSC; Supplier Part Number 3: C965558; JLC Type: Extended

## Sheet Power.SchDoc: On / Off Controller
size A3; SheetNumber: 7; SheetTotal: 7
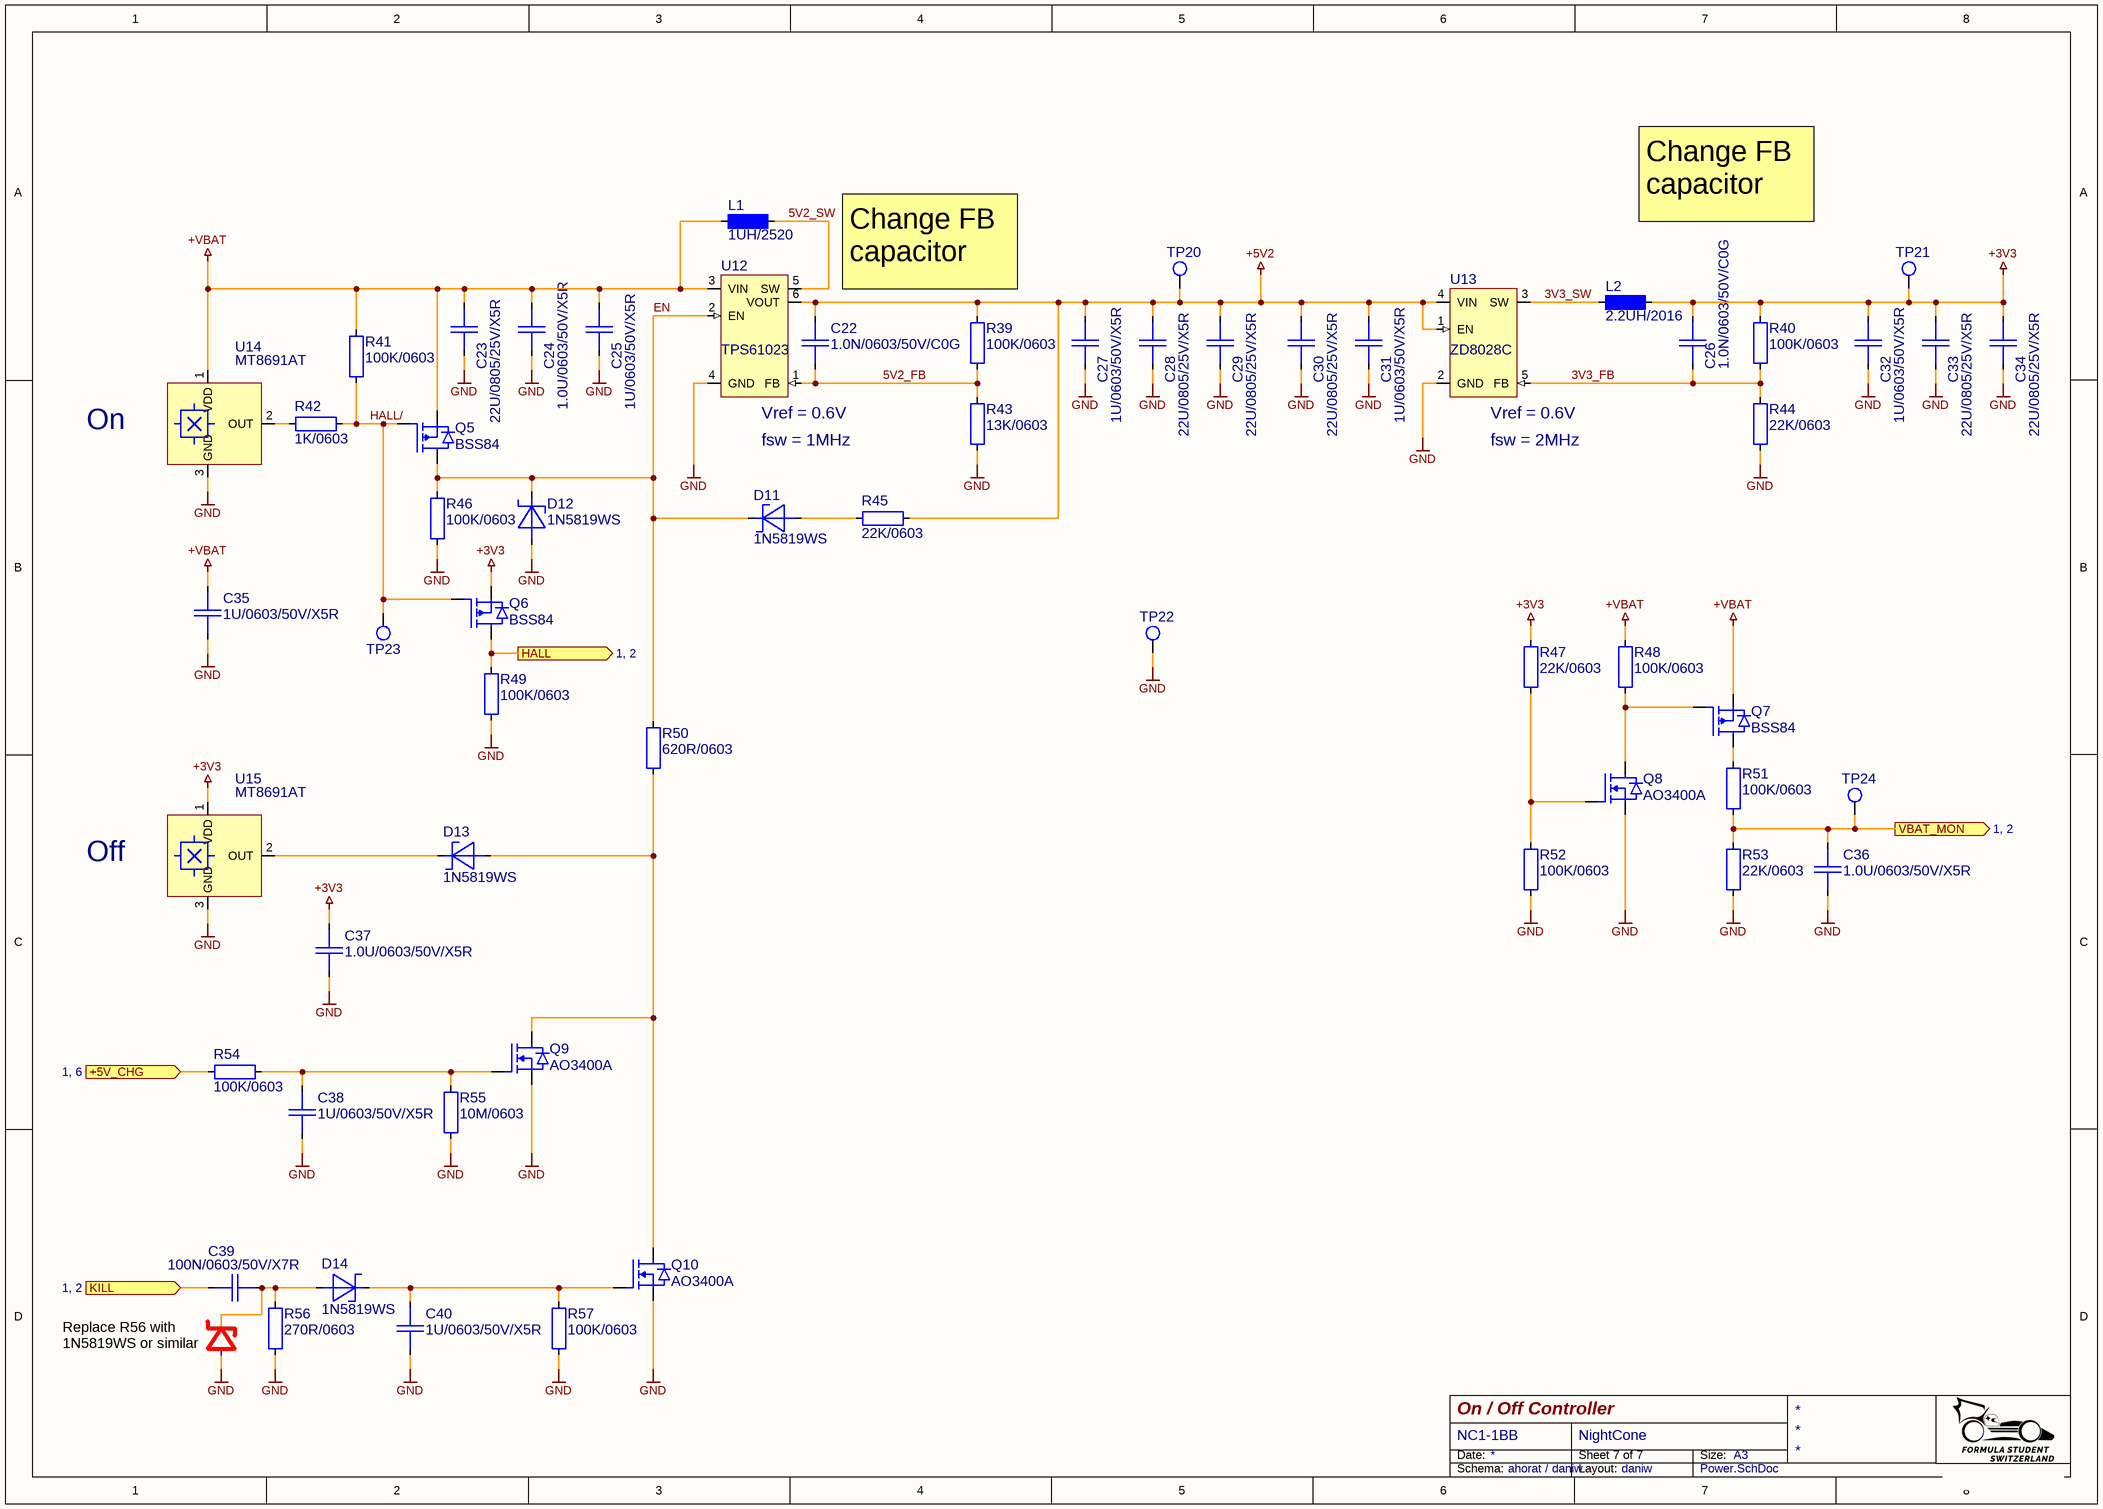
[diagram p3: Power.SchDoc]

### Parts
C22  1.0N/0603/50V/C0G  [CAP0603_C0G]
C23  22U/0805/25V/X5R  [CAP0805_X7R]
C24  1.0U/0603/50V/X5R  [CAP0603_X7R]
C25  1U/0603/50V/X5R  [CAP0603_X7R]
C26  1.0N/0603/50V/C0G  [CAP0603_C0G]
C27  1U/0603/50V/X5R  [CAP0603_X7R]
C28  22U/0805/25V/X5R  [CAP0805_X7R]
C29  22U/0805/25V/X5R  [CAP0805_X7R]
C30  22U/0805/25V/X5R  [CAP0805_X7R]
C31  1U/0603/50V/X5R  [CAP0603_X7R]
C32  1U/0603/50V/X5R  [CAP0603_X7R]
C33  22U/0805/25V/X5R  [CAP0805_X7R]
C34  22U/0805/25V/X5R  [CAP0805_X7R]
C35  1U/0603/50V/X5R  [CAP0603_X7R]
C36  1.0U/0603/50V/X5R  [CAP0603_X7R]
C37  1.0U/0603/50V/X5R  [CAP0603_X7R]
C38  1U/0603/50V/X5R  [CAP0603_X7R]
C39  100N/0603/50V/X7R  [CAP0603_X7R]
C40  1U/0603/50V/X5R  [CAP0603_X7R]
D11  1N5819WS  [SOD2513X100]
D12  1N5819WS  [SOD2513X100]
D13  1N5819WS  [SOD2513X100]
D14  1N5819WS  [SOD2513X100]
L1  1UH/2520  [INDM2520X10]
L2  2.2UH/2016  [INDM2016X10]
Q5  BSS84  [SOT2395P280X125-3-SE]
Q6  BSS84  [SOT2395P280X125-3-SE]
Q7  BSS84  [SOT2395P280X125-3-SE]
Q8  AO3400A  [SOT2395P280X125-3-SE]
Q9  AO3400A  [SOT2395P280X125-3-SE]
Q10  AO3400A  [SOT2395P280X125-3-SE]
R39  100K/0603  [R0603-0.40-WW]
R40  100K/0603  [R0603-0.40-WW]
R41  100K/0603  [R0603-0.40-WW]
R42  1K/0603  [R0603-0.40-WW]
R43  13K/0603  [R0603-0.40-WW]
R44  22K/0603  [R0603-0.40-WW]
R45  22K/0603  [R0603-0.40-WW]
R46  100K/0603  [R0603-0.40-WW]
R47  22K/0603  [R0603-0.40-WW]
R48  100K/0603  [R0603-0.40-WW]
R49  100K/0603  [R0603-0.40-WW]
R50  620R/0603  [R0603-0.40-WW]
R51  100K/0603  [R0603-0.40-WW]
R52  100K/0603  [R0603-0.40-WW]
R53  22K/0603  [R0603-0.40-WW]
R54  100K/0603  [R0603-0.40-WW]
R55  10M/0603  [R0603-0.40-WW]
R56  270R/0603  [R0603-0.40-WW]
R57  100K/0603  [R0603-0.40-WW]
TP20  TP_THD_1.5/0.8  [TP_THD_1.5/0.8]  (value not drawn)  (no BOM)
TP21  TP_THD_1.5/0.8  [TP_THD_1.5/0.8]  (value not drawn)  (no BOM)
TP22  TP_THD_1.5/0.8  [TP_THD_1.5/0.8]  (value not drawn)  (no BOM)
TP23  TP_THD_1.5/0.8  [TP_THD_1.5/0.8]  (value not drawn)  (no BOM)
TP24  TP_THD_1.5/0.8  [TP_THD_1.5/0.8]  (value not drawn)  (no BOM)
U12  TPS61023  [SOT50P160X60-6-SE]
U13  ZD8028C  [SOT2395P280X125-5-SW]
U14  MT8691AT  [SOT2395P280X125-3-SE]
U15  MT8691AT  [SOT2395P280X125-3-SE]

### Ports
+5V_CHG (in, see 1, 6), HALL (out, see 1, 2), KILL (in, see 1, 2), VBAT_MON (out, see 1, 2)

### Nets
+3V3: C26.1 C32.2 C33.1 C34.1 C37.1 L2.2 Q6.2(SOURCE) R40.1 R47.1 TP21.1 U15.1(VDD)
+5V2: C22.1 C27.2 C28.1 C29.1 C30.1 C31.2 R39.1 R45.2 TP20.1 U12.6(VOUT) U13.1(EN) U13.4(VIN)
+VBAT: C23.1 C24.2 C25.2 C35.1 L1.1 Q5.2(SOURCE) Q7.2(SOURCE) R41.1 R48.1 U12.3(VIN) U14.1(VDD)
GND: C23.2 C24.1 C25.1 C27.1 C28.2 C29.2 C30.2 C31.1 C32.1 C33.2 C34.2 C35.2 C36.2 C37.2 C38.2 C40.2 D12.2 Q8.2(SOURCE) Q9.2(SOURCE) Q10.2(SOURCE) R43.1 R44.2 R46.2 R49.2 R52.2 R53.2 R55.2 R56.2 R57.2 TP22.1 U12.4(GND) U13.2(GND) U14.3(GND) U15.3(GND)
3V3_FB: C26.2 R40.2 R44.1 U13.5(FB)
3V3_SW: L2.1 U13.3(SW)
5V2_FB: C22.2 R39.2 R43.2 U12.1(FB)
5V2_SW: L1.2 U12.5(SW)
EN: D11.1 D12.1 Q5.3(DRAIN) R46.1 R50.1 U12.2(EN)
HALL/: Q5.1(GATE) Q6.1(GATE) R41.2 R42.2 TP23.1
NetC36_1: C36.1 R51.2 R53.1 TP24.1 ; port VBAT_MON
NetC38_1: C38.1 Q9.1(GATE) R54.2 R55.1
NetC39_1: C39.1 ; port KILL
NetC39_2: C39.2 D14.2 R56.1
NetC40_1: C40.1 D14.1 Q10.1(GATE) R57.1
NetD11_2: D11.2 R45.1
NetD13_1: D13.1 U15.2(OUT)
NetD13_2: D13.2 Q9.3(DRAIN) Q10.3(DRAIN) R50.2
NetQ6_3: Q6.3(DRAIN) R49.1 ; port HALL
NetQ7_1: Q7.1(GATE) Q8.3(DRAIN) R48.2
NetQ7_3: Q7.3(DRAIN) R51.1
NetQ8_1: Q8.1(GATE) R47.2 R52.1
NetR42_1: R42.1 U14.2(OUT)
NetR54_1: R54.1 ; port +5V_CHG

### Notes on the sheet
- Change FB capacitor
- On
- (near U12) Vref = 0.6V
- fsw = 1MHz
- (near U13) Vref = 0.6V
- (near U13) fsw = 2MHz
- Off
- (near C39) Replace R56 with 1N5819WS or similar
- Date:
- Size:
- A3
- Schema:
- Layout:

### Library data of the parts
C22 C26 = 1.0N/0603/50V/C0G: CAP SM 0603 1.0nF 50V C0G; Manufacturer: GENERIC; Manufacturer 1: YAGEO; Manufacturer Part Number 1: CC0603JRNPO9BN102; Absolute Value: 1E-9; Eurocircuits GPN: GPC0603102-C0G; Part Number: 1.0N/0603/50V/C0G; Package: 0603; Value: 1.0nF; HelpURL: https://www.yageo.com/upload/media/product/productsearch/datasheet/mlcc/UPY-GP_NP0_16V-to-50V_18.pdf; Supplier 1: Digi-Key; Supplier Part Number 1: 311-1423-1-ND; Manufacturer 2: YAGEO; Manufacturer Part Number 2: CC0603KRNPO9BN102; Supplier 2: Digi-Key; Supplier Part Number 2: 311-4026-1-ND
C23 C28-C30 C33 C34 = 22U/0805/25V/X5R: CAP SM 0805 22uF 25V X5R; Manufacturer: GENERIC; Absolute Value: 2.2E-5; Part Number: 22U/0805/25V/X5R; Package: 805; Value: 22uF; Manufacturer Part Number 3: CL21A226MAQNNNE; Supplier 3: LCSC; Supplier Part Number 3: C45783; JLC Type: Basic
C24 C36 C37 = 1.0U/0603/50V/X5R: as C1 on sheet Control; Part Number: 1.0U/0603/50V/X5R; Package: 0603; Value: 1.0uF; Manufacturer Part Number 3: CL10A105KB8NNNC; Supplier 3: LCSC; Supplier Part Number 3: C15849; JLC Type: Basic; HelpURL: https://mm.digikey.com/Volume0/opasdata/d220001/medias/docus/658/CL10A105KB8NNNC_Spec.pdf; Supplier 1: Digi-Key; Supplier Part Number 1: 1276-1860-1-ND
C25 C27 C31 C32 C35 C38 C40 = 1U/0603/50V/X5R: as C4 on sheet FailSafe; Part Number: 1U/0603/50V/X5R; Package: 603; Value: 1.0uF; Manufacturer Part Number 3: CL10A105KB8NNNC; Supplier 3: LCSC; Supplier Part Number 3: C15849; JLC Type: Basic
C39 = 100N/0603/50V/X7R: CAP SM 0603 100nF 50V X7R; Manufacturer: GENERIC; Manufacturer 1: YAGEO; Manufacturer Part Number 1: CC0603KPX7R9BB104; Absolute Value: 1E-7; Part Number: 100N/0603/50V/X7R; Package: 603; Value: 100nF; HelpURL: https://www.yageo.com/upload/media/product/app/datasheet/mlcc/upy-gphc_x7r_6_3v-to-250v.pdf; Supplier 1: Digi-Key; Supplier Part Number 1: 311-3567-1-ND; Manufacturer 2: YAGEO; Manufacturer Part Number 2: CC0603MRX7R9BB104; Supplier 2: Digi-Key; Supplier Part Number 2: 311-4110-1-ND; Manufacturer Part Number 3: CC0603KRX7R9BB104; Supplier 3: LCSC; Supplier Part Number 3: C14663; JLC Type: Basic
D11-D14 = 1N5819WS: as D1 on sheet FailSafe; Part Number: 1N5819WS; Package: SOD323; Value: 1N5819WS; Absolute Value: 40V; HelpURL: https://datasheet.lcsc.com/lcsc/2204281430_Guangdong-Hottech-1N5819WS_C191023.pdf; Manufacturer 3: Guangdong Hottech; Manufacturer Part Number 3: 1N5819WS; Supplier 3: LCSC; Supplier Part Number 3: C191023; JLC Type: Basic
L1 = 1UH/2520: 1UH 2520 Shielded Inductor SMD; Manufacturer: GENERIC; Manufacturer 1: INPAQ Technology Co., Ltd; Manufacturer Part Number 1: WIP252010S-1R0MLDG; Absolute Value: 1E-6; Part Number: 1UH/2520; Package: 2520 metric; Value: 1UH; HelpURL: https://mm.digikey.com/Volume0/opasdata/d220001/medias/docus/5561/WIP252010S%20L%20Series.pdf; Supplier 1: Digi-Key; Supplier Part Number 1: 3526-WIP252010S-1R0MLDGCT-ND; Manufacturer 3: INPAQ; Manufacturer Part Number 3: WIP252012P-1R0ML; Supplier 3: LCSC; Supplier Part Number 3: C315711; JLC Type: Extended
L2 = 2.2UH/2016: 2.2UH 2016 Shielded Inductor SMD; Manufacturer: GENERIC; Manufacturer 1: INPAQ Technology Co., Ltd; Manufacturer Part Number 1: WIP201610S-2R2MLDG; Absolute Value: 2.2E-6; Part Number: 2.2UH/2016; Package: 2016 metric; Value: 2.2UH; HelpURL: https://mm.digikey.com/Volume0/opasdata/d220001/medias/docus/5561/WIP201610S%20L%20Series.pdf; Supplier 1: Digi-Key; Supplier Part Number 1: 3526-WIP201610S-2R2MLDGCT-ND; Manufacturer 3: INPAQ; Manufacturer Part Number 3: WIP201610P-2R2ML; Supplier 3: LCSC; Supplier Part Number 3: C315717; JLC Type: Extended
Q5-Q7 = BSS84: 50V P-Channel MOSFET; Manufacturer: GENERIC; Manufacturer 1: Good-Ark Semiconductor; Part Number: BSS84; Package: SOT23; HelpURL: https://goodarksemi.com/docs/datasheets/mosfets/BSS84.pdf; Manufacturer Part Number 1: BSS84; Supplier 1: Digi-Key; Supplier Part Number 1: 4786-BSS84CT-ND; Manufacturer 3: Jiangsu Changjing Electronics Technology Co., Ltd.; Manufacturer Part Number 3: BSS84; Supplier 3: LCSC; Supplier Part Number 3: C114481; JLC Type: Extended
Q8-Q10 = AO3400A: as Q1 on sheet FailSafe; Part Number: AO3400A; Package: SOT23; HelpURL: https://aosmd.com/res/data_sheets/AO3400A.pdf; Manufacturer 3: Alpha & Omega Semiconductor; Manufacturer Part Number 3: AO3400A; Supplier 3: LCSC; Supplier Part Number 3: C20917; JLC Type: Basic
R39-R41 R46 R48 R49 R51 R52 R54 R57 = 100K/0603: as R19 on sheet FailSafe; Part Number: 100K/0603; Package: 0603; Value: 100K; HelpURL: https://www.yageo.com/upload/media/product/productsearch/datasheet/rchip/PYu-RC_Group_51_RoHS_L_12.pdf; Supplier 1: Digi-Key; Supplier Part Number 1: 13-RC0603FR-13100KLCT-ND; Manufacturer 2: YAGEO; Manufacturer Part Number 2: RC0603FR-10100KL; Supplier 2: Digi-Key; Supplier Part Number 2: 13-RC0603FR-10100KLCT-ND; Manufacturer 3: UNI-ROYAL(Uniroyal Elec); Manufacturer Part Number 3: 0603WAF1003T5E; Supplier 3: LCSC; Supplier Part Number 3: C25803; JLC Type: Basic
R42 = 1K/0603: RES SM 0603 1K; Manufacturer: GENERIC; Manufacturer 1: YAGEO; Manufacturer Part Number 1: RC0603FR-131KL; Absolute Value: 1000; Eurocircuits GPN: GPR06031K; Part Number: 1K/0603; Package: 0603; Value: 1K; HelpURL: https://www.yageo.com/upload/media/product/app/datasheet/rchip/pyu-rc_group_51_rohs_l.pdf; Supplier 1: Digi-Key; Supplier Part Number 1: 13-RC0603FR-131KLCT-ND; Manufacturer 2: YAGEO; Manufacturer Part Number 2: RC0603FR-101KL; Supplier 2: Digi-Key; Supplier Part Number 2: 13-RC0603FR-101KLCT-ND; Manufacturer 3: UNI-ROYAL(Uniroyal Elec); Manufacturer Part Number 3: 0603WAF1001T5E; Supplier 3: LCSC; Supplier Part Number 3: C21190; JLC Type: Basic
R43 = 13K/0603: RES SM 0603 13K; Manufacturer: GENERIC; Manufacturer 1: YAGEO; Manufacturer Part Number 1: RC0603FR-1313KL; Absolute Value: 13000; Part Number: 13K/0603; Package: 0603; Value: 13K; HelpURL: https://www.yageo.com/upload/media/product/productsearch/datasheet/rchip/PYu-RC_Group_51_RoHS_L_12.pdf; Supplier 1: Digi-Key; Supplier Part Number 1: 13-RC0603FR-1313KLCT-ND; Manufacturer 2: YAGEO; Manufacturer Part Number 2: RC0603FR-1013KL; Supplier 2: Digi-Key; Supplier Part Number 2: 13-RC0603FR-1013KLCT-ND; Manufacturer 3: UNI-ROYAL(Uniroyal Elec); Manufacturer Part Number 3: 0603WAF1302T5E; Supplier 3: LCSC; Supplier Part Number 3: C22797; JLC Type: Basic
R44 R45 R47 R53 = 22K/0603: RES SM 0603 22K; Manufacturer: GENERIC; Manufacturer 1: YAGEO; Manufacturer Part Number 1: RC0603FR-1322KL; Absolute Value: 22000; Part Number: 22K/0603; Package: 0603; Value: 22K; HelpURL: https://www.yageo.com/upload/media/product/app/datasheet/rchip/pyu-rc_group_51_rohs_l.pdf; Supplier 1: Digi-Key; Supplier Part Number 1: 13-RC0603FR-1322KLCT-ND; Manufacturer 2: YAGEO; Manufacturer Part Number 2: RC0603FR-1022KL; Supplier 2: Digi-Key; Supplier Part Number 2: 13-RC0603FR-1022KLCT-ND; Manufacturer 3: UNI-ROYAL(Uniroyal Elec); Manufacturer Part Number 3: 0603WAF2202T5E; Supplier 3: LCSC; Supplier Part Number 3: C31850; JLC Type: Basic
R50 = 620R/0603: RES SM 0603 620R; Manufacturer: GENERIC; Manufacturer 1: YAGEO; Manufacturer Part Number 1: RC0603FR-13620RL; Absolute Value: 620; Eurocircuits GPN: GPR0603620R; Part Number: 620R/0603; Package: 0603; Value: 620R; HelpURL: https://www.yageo.com/upload/media/product/productsearch/datasheet/rchip/PYu-RC_Group_51_RoHS_L_12.pdf; Supplier 1: Digi-Key; Supplier Part Number 1: 13-RC0603FR-13620RLCT-ND; Manufacturer 2: YAGEO; Manufacturer Part Number 2: RC0603FR-10620RL; Supplier 2: Digi-Key; Supplier Part Number 2: 13-RC0603FR-10620RLCT-ND
R55 = 10M/0603: RES SM 0603 10M; Manufacturer: GENERIC; Manufacturer 1: YAGEO; Manufacturer Part Number 1: RC0603FR-1310ML; Absolute Value: 10000000; Part Number: 10M/0603; Package: 603; Value: 10M; HelpURL: https://www.yageo.com/upload/media/product/productsearch/datasheet/rchip/PYu-RC_Group_51_RoHS_L_12.pdf; Supplier 1: Digi-Key; Supplier Part Number 1: 13-RC0603FR-1310MLCT-ND; Manufacturer 2: YAGEO; Manufacturer Part Number 2: RC0603FR-1010ML; Supplier 2: Digi-Key; Supplier Part Number 2: 13-RC0603FR-1010MLCT-ND; Manufacturer 3: UNI-ROYAL(Uniroyal Elec); Manufacturer Part Number 3: 0603WAF1005T5E; Supplier 3: LCSC; Supplier Part Number 3: C7250; JLC Type: Basic
R56 = 270R/0603: as R24 on sheet FailSafe; Part Number: 270R/0603; Package: 0603; Value: 270R; HelpURL: https://www.yageo.com/upload/media/product/productsearch/datasheet/rchip/PYu-RC_Group_51_RoHS_L_12.pdf; Supplier 1: Digi-Key; Supplier Part Number 1: 13-RC0603FR-13270RLCT-ND; Manufacturer 2: YAGEO; Manufacturer Part Number 2: RC0603FR-10270RL; Supplier 2: Digi-Key; Supplier Part Number 2: 13-RC0603FR-10270RLCT-ND; Manufacturer 3: UNI-ROYAL(Uniroyal Elec); Manufacturer Part Number 3: 0603WAF2700T5E; Supplier 3: LCSC; Supplier Part Number 3: C22966; JLC Type: Basic
TP20-TP24 = TP_THD_1.5/0.8: as TP1 on sheet Control; Part Number: TP_THD_1.5/0.8
U12 = TPS61023: 3.7-A Boost Converter with 0.5-V Ultra-low Input Voltage; Manufacturer: Texas Instruments; Part Number: TPS61023; Package: SOT563; HelpURL: https://www.ti.com/lit/ds/symlink/tps61023.pdf; Manufacturer 1: Texas Instruments; Manufacturer Part Number 1: TPS61023; Supplier 1: Digi-Key; Supplier Part Number 1: 296-TPS61023DRLRTR-ND; Manufacturer 3: Texas Instruments; Manufacturer Part Number 3: TPS61023; Supplier 3: LCSC; Supplier Part Number 3: C919459; JLC Type: Extended
U13 = ZD8028C: 1.5A 2MHz 5.5V Synchronous Buck Converter; Manufacturer: Zetta; Part Number: ZD8028C; Package: SOT23-5; HelpURL: https://datasheet.lcsc.com/lcsc/2203221830_Zetta-ZD8028IB5TR_C2928932.pdf; Manufacturer 3: Zetta; Manufacturer Part Number 3: ZD8028IB5TR; Supplier 3: LCSC; Supplier Part Number 3: C2928932; JLC Type: Extended
U14 U15 = MT8691AT: MT8691AT Uni-polar, Nano Power Hall-Effect Switch IC; Manufacturer: Magn Tek; Part Number: MT8691AT; Package: SOT23; HelpURL: https://www.lcsc.com/datasheet/lcsc_datasheet_2304140030_Magn-Tek-MT8691AT_C879625.pdf; Manufacturer 3: Magn Tek; Manufacturer Part Number 3: MT8691AT; Supplier 3: LCSC; Supplier Part Number 3: C879625; JLC Type: Extended

## Nets that join several sheets
+3V3: Control (16 pins), Power (11 pins)
+5V2: FailSafe (15 pins), Lights (C17.1 R29.1 U9.2), Power (12 pins)
GND: Control (15 pins), FailSafe (19 pins), Lights (C16.2 C17.2 U9.5), Power (34 pins)

## Assembly variants
WS2813B-B: not fitted Q2 R1 R2 R6 R7 R8 R27 R30 R33 R36 R39 R42 R45 R48 R51 R54 R57 R60 R63 R66 R69 R72 R75 R78 R81; alternate parts U8 -> WS2813B-B, U15 -> WS2813B-B, U16 -> WS2813B-B, U17 -> WS2813B-B, U18 -> WS2813B-B, U19 -> WS2813B-B, U20 -> WS2813B-B, U21 -> WS2813B-B, U22 -> WS2813B-B, U23 -> WS2813B-B, U24 -> WS2813B-B, U25 -> WS2813B-B, U26 -> WS2813B-B, U9 -> WS2813B-B, U10 -> WS2813B-B, U11 -> WS2813B-B, U12 -> WS2813B-B, U13 -> WS2813B-B, U14 -> WS2813B-B
WS2813B-V5: not fitted C15 C17 C19 C21 C23 C25 C27 C29 C31 C33 C35 C37 C39 C41 C43 C45 C47 C49 C51 C52 Q2 R1 R2 R6 R7 R8 R26 R28 R29 R31 R32 R34 R35 R37 R38 R40 R41 R43 R44 R46 R47 R49 R50 R52 R53 R55 R56 R58 R59 R61 R62 R64 R65 R67 R68 R70 R71 R73 R74 R76 R77 R79 R80 R82 R83; alternate parts R23 -> 910R/0603, R25 -> 1K2/0603, U8 -> WS2813B-V5, U9 -> WS2813B-V5, U16 -> WS2813B-V5, U17 -> WS2813B-V5, U18 -> WS2813B-V5, U19 -> WS2813B-V5, U20 -> WS2813B-V5, U22 -> WS2813B-V5, U23 -> WS2813B-V5, U21 -> WS2813B-V5, U25 -> WS2813B-V5, U26 -> WS2813B-V5, U24 -> WS2813B-V5, U10 -> WS2813B-V5, U13 -> WS2813B-V5, U12 -> WS2813B-V5, U14 -> WS2813B-V5, U15 -> WS2813B-V5, U11 -> WS2813B-V5
WS2813C: not fitted Q2 R1 R2 R6 R7 R8 R27 R30 R33 R36 R39 R42 R45 R48 R51 R54 R57 R60 R63 R66 R69 R72 R75 R78 R81; alternate parts U8 -> WS2813C, U15 -> WS2813C, U16 -> WS2813C, U17 -> WS2813C, U18 -> WS2813C, U19 -> WS2813C, U20 -> WS2813C, U21 -> WS2813C, U22 -> WS2813C, U23 -> WS2813C, U24 -> WS2813C, U25 -> WS2813C, U26 -> WS2813C, U9 -> WS2813C, U10 -> WS2813C, U11 -> WS2813C, U12 -> WS2813C, U13 -> WS2813C, U14 -> WS2813C
WS2813E: not fitted C15 C17 C19 C21 C23 C25 C27 C29 C31 C33 C35 C37 C39 C41 C43 C45 C47 C49 C51 C52 Q2 R1 R2 R6 R7 R8 R26 R27 R29 R30 R32 R33 R35 R36 R38 R39 R41 R42 R44 R45 R47 R48 R50 R51 R53 R54 R56 R57 R59 R60 R62 R63 R65 R66 R68 R69 R71 R72 R74 R75 R77 R78 R80 R81 R83; alternate parts U8 -> WS2813E, U15 -> WS2813E, U16 -> WS2813E, U17 -> WS2813E, U18 -> WS2813E, U19 -> WS2813E, U20 -> WS2813E, U21 -> WS2813E, U22 -> WS2813E, U23 -> WS2813E, U24 -> WS2813E, U25 -> WS2813E, U26 -> WS2813E, U9 -> WS2813E, U10 -> WS2813E, U11 -> WS2813E, U12 -> WS2813E, U13 -> WS2813E, U14 -> WS2813E